# Altium schematic sheet DAC.SchDoc
size Tabloid; DocumentNumber: 7; SheetNumber: 7; SheetTotal: 11; SheetName: DAC; Size: 11x17; Sheet_Name: DAC
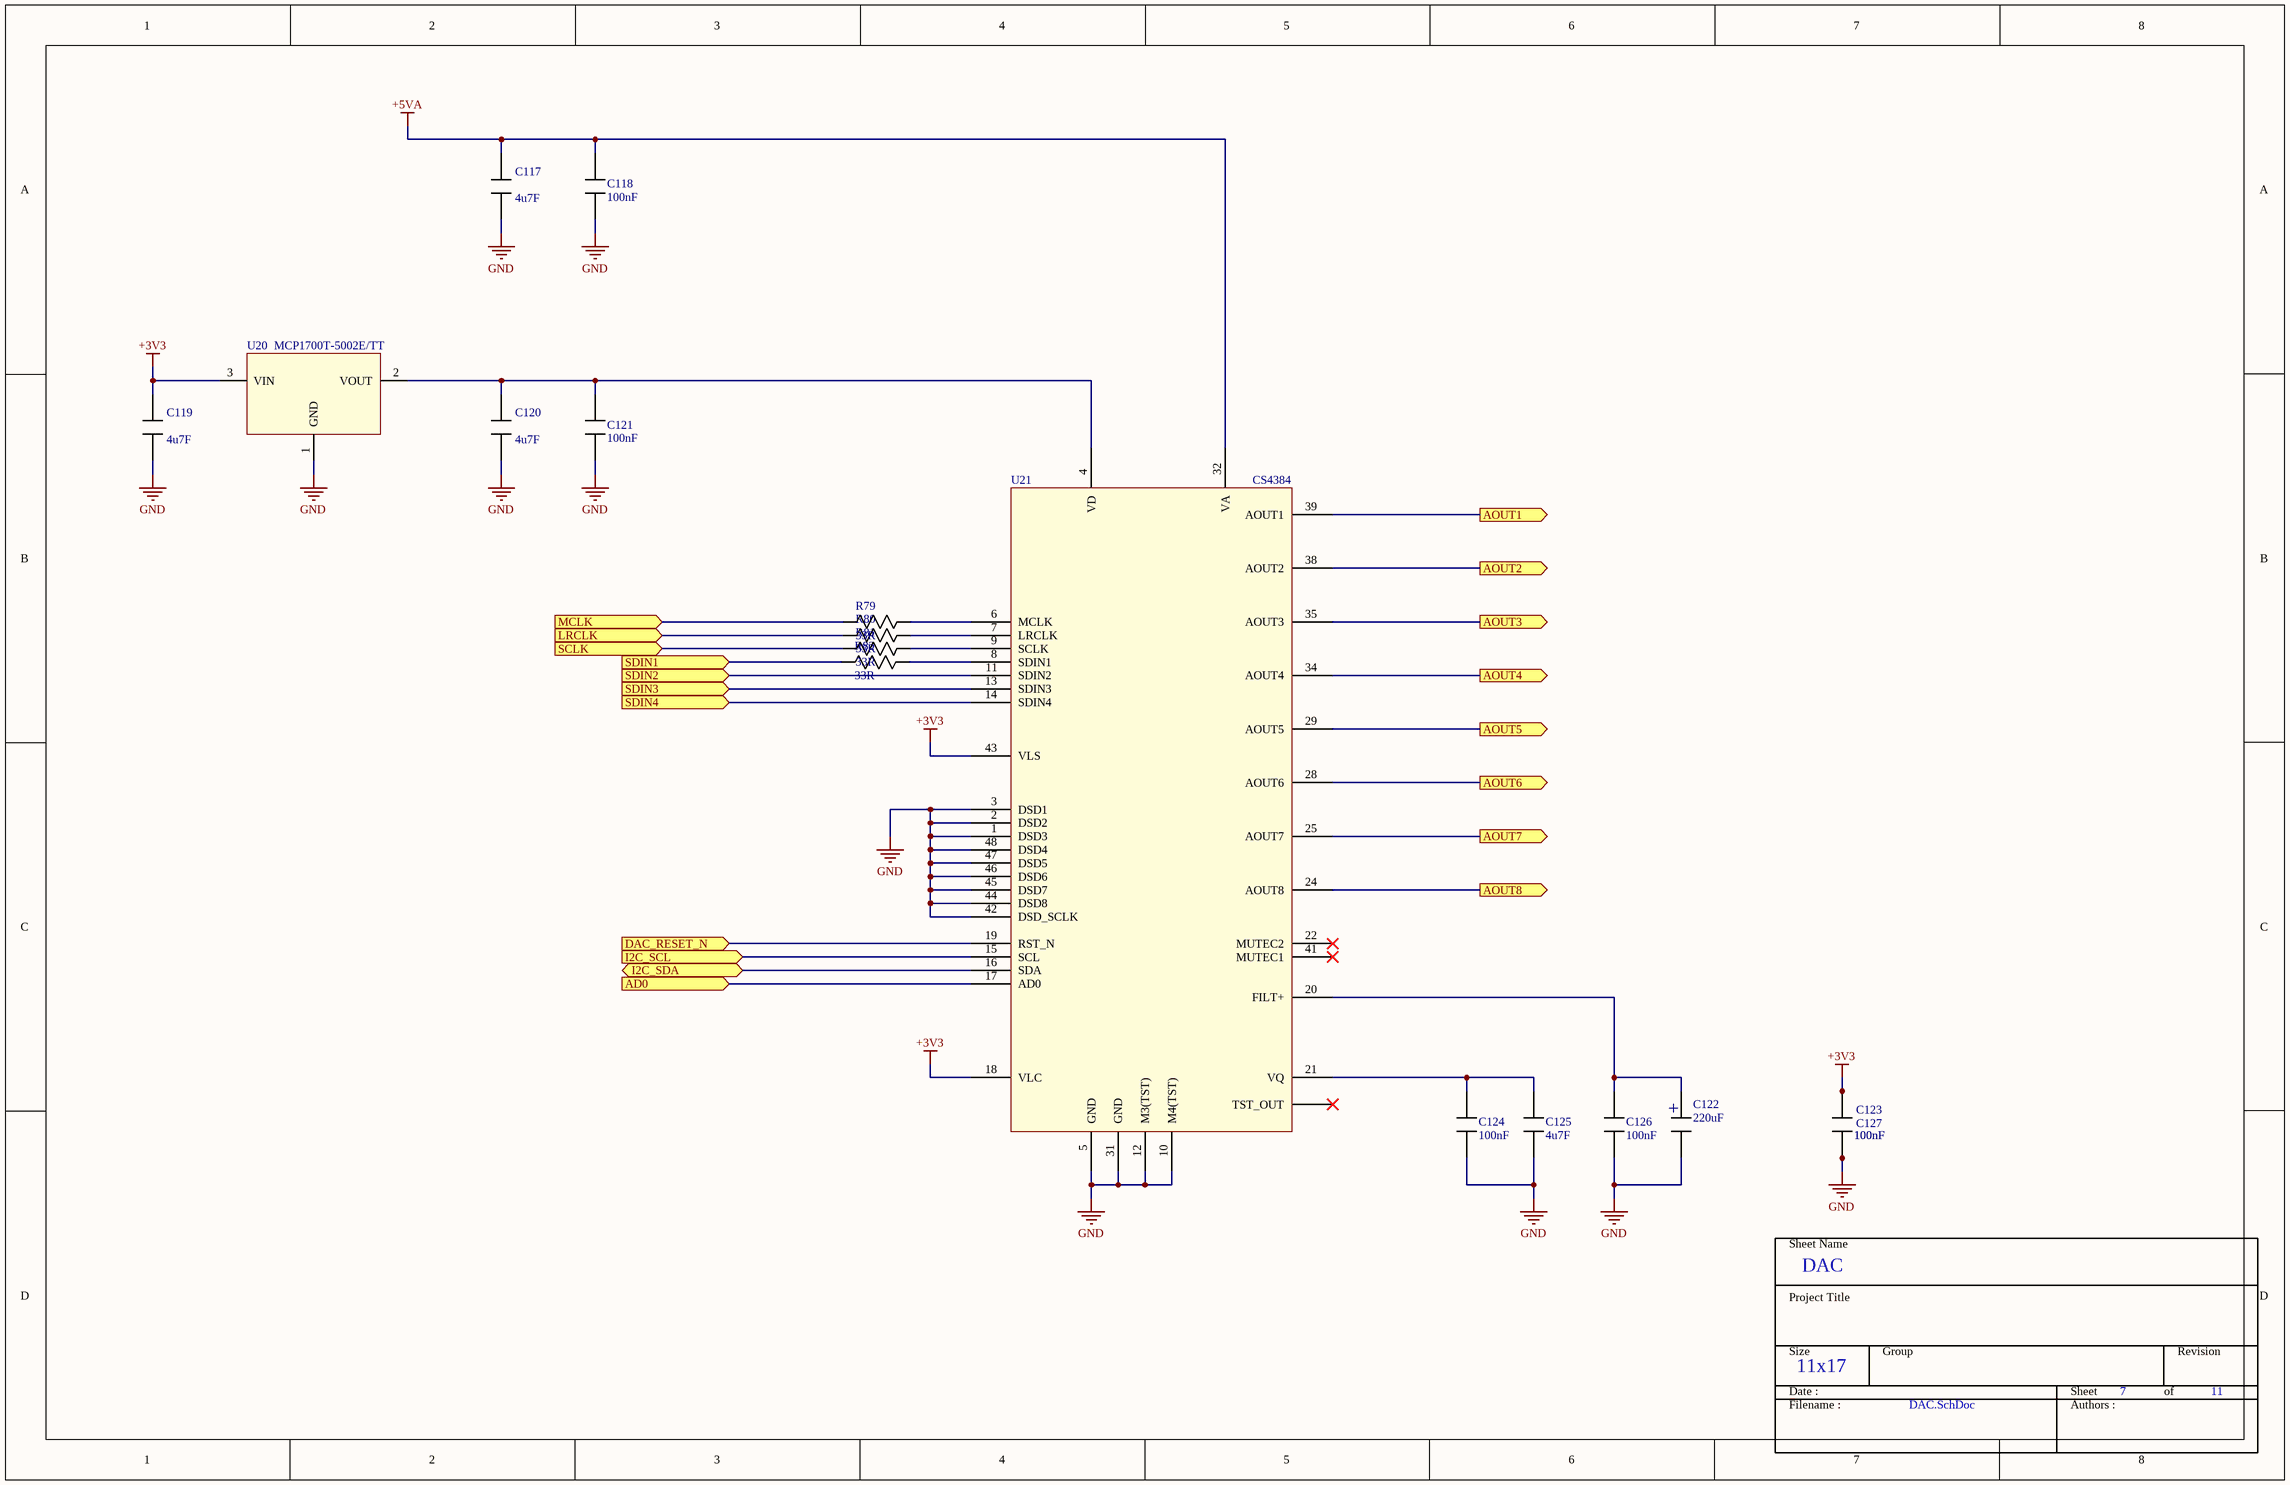
[diagram p0: DAC.SchDoc]

## Parts
C117  value 4u7F  [0603]  (hidden comment: Capacitor)
C118  value 100nF  [0603]  (hidden comment: Capacitor)
C119  value 4u7F  [0603]  (hidden comment: Capacitor)
C120  value 4u7F  [0603]  (hidden comment: Capacitor)
C121  value 100nF  [0603]  (hidden comment: Capacitor)
C122  value 220uF  [CAP_RAD_SMD_DIA315]  (hidden comment: Capacitor_Polarized_1)
C123  value 100nF  [0603]  (hidden comment: Capacitor)
C124  value 100nF  [0603]  (hidden comment: Capacitor)
C125  value 4u7F  [0603]  (hidden comment: Capacitor)
C126  value 100nF  [0603]  (hidden comment: Capacitor)
C127  value 100nF  [0603]  (hidden comment: Capacitor)
R79  value 33R  [0603]  (hidden comment: Resistor)
R80  value 33R  [0603]  (hidden comment: Resistor)
R81  value 33R  [0603]  (hidden comment: Resistor)
R82  value 33R  [0603]  (hidden comment: Resistor)
U20  Mfg_PN: MCP1700T-5002E/TT  [SOT23_132]  (hidden comment: MCP1700)
U21  CS4384  [LQFP_48L_CIRRUS]

## Ports
AD0 (in), AOUT1 (out), AOUT2 (out), AOUT3 (out), AOUT4 (out), AOUT5 (out), AOUT6 (out), AOUT7 (out), AOUT8 (out), DAC_RESET_N (in), I2C_SCL (in), I2C_SDA (bidir), LRCLK (in), MCLK (in), SCLK (in), SDIN1 (in), SDIN2 (in), SDIN3 (in), SDIN4 (in)

## Nets
+3V3: C119.1 C123.1 C127.1 U20.3(VIN) U21.18(VLC) U21.43(VLS)
+5VA: C117.1 C118.1 U21.32(VA)
GND: C117.2 C118.2 C119.2 C120.2 C121.2 C122.- C123.2 C124.2 C125.2 C126.2 C127.2 U20.1(GND) U21.1(DSD3) U21.2(DSD2) U21.3(DSD1) U21.5(GND) U21.10(M4(TST)) U21.12(M3(TST)) U21.31(GND) U21.42(DSD_SCLK) U21.44(DSD8) U21.45(DSD7) U21.46(DSD6) U21.47(DSD5) U21.48(DSD4)
AD0: U21.17(AD0) ; port AD0
AOUT1: U21.39(AOUT1) ; port AOUT1
AOUT2: U21.38(AOUT2) ; port AOUT2
AOUT3: U21.35(AOUT3) ; port AOUT3
AOUT4: U21.34(AOUT4) ; port AOUT4
AOUT5: U21.29(AOUT5) ; port AOUT5
AOUT6: U21.28(AOUT6) ; port AOUT6
AOUT7: U21.25(AOUT7) ; port AOUT7
AOUT8: U21.24(AOUT8) ; port AOUT8
DAC_RESET_N: U21.19(RST_N) ; port DAC_RESET_N
I2C_SCL: U21.15(SCL) ; port I2C_SCL
I2C_SDA: U21.16(SDA) ; port I2C_SDA
LRCLK: R80.1 ; port LRCLK
MCLK: R79.1 ; port MCLK
SCLK: R81.1 ; port SCLK
SDIN1: R82.1 ; port SDIN1
SDIN2: U21.11(SDIN2) ; port SDIN2
SDIN3: U21.13(SDIN3) ; port SDIN3
SDIN4: U21.14(SDIN4) ; port SDIN4
NetC120_1: C120.1 C121.1 U20.2(VOUT) U21.4(VD)
NetC122_+: C122.+ C126.1 U21.20(FILT+)
NetC124_1: C124.1 C125.1 U21.21(VQ)
NetR79_2: R79.2 U21.6(MCLK)
NetR80_2: R80.2 U21.7(LRCLK)
NetR81_2: R81.2 U21.9(SCLK)
NetR82_2: R82.2 U21.8(SDIN1)

Not connected (* = marked no-connect by the designer): U21 22(MUTEC2)* 23(TST_OUT) 26(TST_OUT) 27(TST_OUT) 30(TST_OUT) 33(TST_OUT) 36(TST_OUT) 37(TST_OUT) 40(TST_OUT)* 41(MUTEC1)*

## Notes on the sheet
- Sheet Name
- Project Title
- Size
- Group
- Revision
- Date :
- Filename :
- Sheet
- Authors :
- of

## Library data of the parts
C117 C119 C120 C125 = Capacitor: Mfg: Samsung; Mfg_PN: CL21A475KAQNNNG; HelpURL: *; NI: *; Supplier1: Digikey; Supplier1_PN: 1276-6462-1-ND; Tolerance: *; Type: *; Rating: *
C118 C121 C123 C124 C126 C127 = Capacitor: Mfg: Samsung; Mfg_PN: CL10F104ZO8NNNC; HelpURL: *; NI: *; Supplier1: Digikey; Supplier1_PN: 1276-1258-1-ND; Tolerance: *; Type: *; Rating: *
C122 = Capacitor_Polarized_1: Capacitor; Mfg: Nichicon; Mfg_PN: UWT1E221MNL1GS; HelpURL: *; NI: *; Supplier1: Digikey; Supplier1_PN: 493-2192-1-ND; Tolerance: *; Type: *; Rating: *
R79-R82 = Resistor: Mfg: Yageo; Mfg_PN: RC0603JR-0733RL; HelpURL: *; NI: *; Supplier1: Digikey; Supplier1_PN: 311-33GRCT-ND; Type: *; Rating: *; Tolerance: *
U20 = MCP1700: Linear voltage regulator; Mfg: Microchip; HelpURL: http://ww1.microchip.com/downloads/en/DeviceDoc/20001826C.pdf; NI: *; Supplier1: Digikey; Supplier1_PN: MCP1700T5002ETTCT-ND; Type: *
U21 = CS4384: DAC, 24-bit, 8 chan, 192kHz, PCM, TDM, DSD, LQFP48; Mfg: Cirrus; Mfg_PN: CS4384-CQZ; Supplier1: Digikey; Supplier1_PN: 598-1062-ND